# Altium schematic sheet Sheet1.SchDoc
size A4
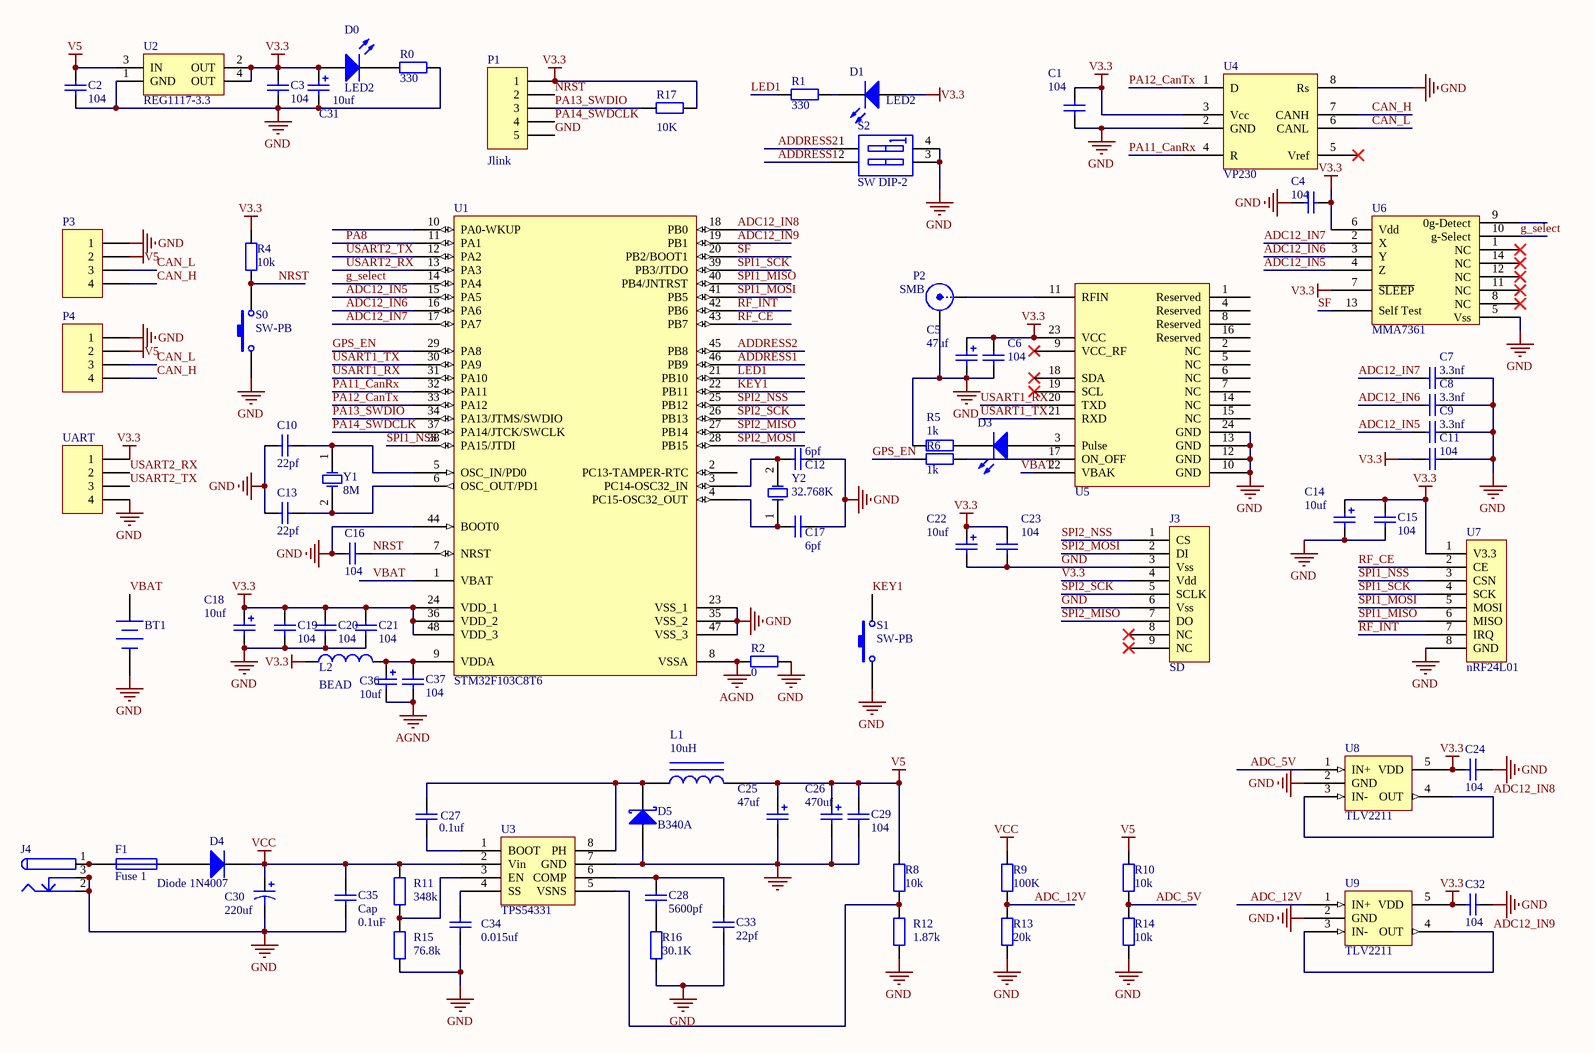
[diagram p0: Sheet1.SchDoc]

## Parts
BT1  Battery  [LI1220_1]  (value not drawn)
C1  value 104  [C0805]  (hidden comment: Cap)
C2  value 104  [C0805]  (hidden comment: Cap)
C3  value 104  [C0805]  (hidden comment: Cap)
C4  value 104  [C0805]  (hidden comment: Cap)
C5  value 47uf  [1812]  (hidden comment: Cap Pol2)
C6  value 104  [C0805]  (hidden comment: Cap)
C7  value 3.3nf  [C0805]  (hidden comment: Cap)
C8  value 3.3nf  [C0805]  (hidden comment: Cap)
C9  value 3.3nf  [C0805]  (hidden comment: Cap)
C10  value 22pf  [C0805]  (hidden comment: Cap)
C11  value 104  [C0805]  (hidden comment: Cap)
C12  value 6pf  [C0805]  (hidden comment: Cap)
C13  value 22pf  [C0805]  (hidden comment: Cap)
C14  value 10uf  [1206]  (hidden comment: Cap Pol2)
C15  value 104  [C0805]  (hidden comment: Cap)
C16  value 104  [C0805]  (hidden comment: Cap)
C17  value 6pf  [C0805]  (hidden comment: Cap)
C18  value 10uf  [1206]  (hidden comment: Cap Pol2)
C19  value 104  [C0805]  (hidden comment: Cap)
C20  value 104  [C0805]  (hidden comment: Cap)
C21  value 104  [C0805]  (hidden comment: Cap)
C22  value 10uf  [1206]  (hidden comment: Cap Pol2)
C23  value 104  [C0805]  (hidden comment: Cap)
C24  value 104  [C0805]  (hidden comment: Cap)
C25  value 47uf  [1812]  (hidden comment: Cap Pol2)
C26  value 470uf  [Cap8*8]  (hidden comment: Cap Pol2)
C27  value 0.1uf  [C0805]  (hidden comment: Cap)
C28  value 5600pf  [C0805]  (hidden comment: Cap)
C29  value 104  [C0805]  (hidden comment: Cap)
C30  value 220uf  [Cap8*8]  (hidden comment: Cap Pol1)
C31  value 10uf  [1206]  (hidden comment: Cap Pol2)
C32  value 104  [C0805]  (hidden comment: Cap)
C33  value 22pf  [C0805]  (hidden comment: Cap)
C34  value 0.015uf  [C0805]  (hidden comment: Cap)
C35  Cap  value 0.1uF  [C0805]
C36  value 10uf  [1206]  (hidden comment: Cap Pol2)
C37  value 104  [C0805]  (hidden comment: Cap)
D0  LED2  [C0805]
D1  LED2  [C0805]
D3  LED2  [C0805]  (value not drawn)
D4  Diode 1N4007  [SMB]
D5  B340A  [SMB]
F1  Fuse 1  [1812]
J3  SD  [SD_LOCK]
J4  PWR2.5  [KLD-0202]  (value not drawn)
L1  value 10uH  [l]  (hidden comment: Inductor Iron)
L2  value BEAD  [C0805]  (hidden comment: Inductor)
P1  Jlink  [HDR1X5]
P2  SMB  [SMB_V-RJ45]
P3  Header 4  [DuraClik*4]  (value not drawn)
P4  Header 4  [DuraClik*4]  (value not drawn)
R0  value 330  [C0805]  (hidden comment: Res2)
R1  value 330  [C0805]  (hidden comment: Res2)
R2  value 0  [C0805]  (hidden comment: Res2)
R4  value 10k  [C0805]  (hidden comment: Res2)
R5  value 1k  [C0805]  (hidden comment: Res2)
R6  value 1k  [C0805]  (hidden comment: Res2)
R8  value 10k  [C0805]  (hidden comment: Res2)
R9  value 100K  [C0805]  (hidden comment: Res2)
R10  value 10k  [C0805]  (hidden comment: Res2)
R11  value 348k  [C0805]  (hidden comment: Res2)
R12  value 1.87k  [C0805]  (hidden comment: Res2)
R13  value 20k  [C0805]  (hidden comment: Res2)
R14  value 10k  [C0805]  (hidden comment: Res2)
R15  value 76.8k  [C0805]  (hidden comment: Res2)
R16  value 30.1K  [C0805]  (hidden comment: Res2)
R17  value 10K  [C0805]  (hidden comment: Res2)
S0  SW-PB  [button_SMD]
S1  SW-PB  [button_SMD]
S2  SW DIP-2  [DIP-4]
U1  STM32F103C8T6  [LQFP48_N]
U2  REG1117-3.3  [ZZ311]
U3  TPS54331  [SOIC8_M]
U4  VP230  [SOP8_N]
U5  L20  [L20]  (value not drawn)
U6  MMA7361  [MMA7361 - duplicate]
U7  nRF24L01  [NRF24L01 PA]
U8  TLV2211  [SOT-23-5]
U9  TLV2211  [SOT-23-5]
UART  Header 4  [HDR1X4]  (value not drawn)
Y1  8M  [XTAL]
Y2  32.768K  [XTAL32]

## Nets
AGND: C36.2 C37.2 R2.1 U1.8(VSSA)
GND: BT1.2(-) C1.1 C2.2 C3.2 C4.1 C5.2 C6.1 C7.2 C8.2 C9.2 C10.1 C11.1 C12.1 C13.1 C14.2 C15.2 C16.1 C17.1 C18.2 C19.2 C20.2 C21.2 C22.2 C23.2 C24.2 C25.2 C26.2 C29.1 C30.2 C31.2 C32.2 C33.2 C34.2 C35.2 D5.1(A) J3.3(Vss) J3.6(Vss) J4.2 J4.2A J4.2B J4.3 J4.3A J4.3B P1.5 P2.2(Y) P3.1 P4.1 R0.1 R2.2 R5.2 R12.2 R13.2 R14.2 R15.2 R16.2 S0.1 S1.1 S2.3(B2) S2.4(B1) U1.23(VSS_1) U1.35(VSS_2) U1.44(BOOT0) U1.47(VSS_3) U2.1(GND) U3.7(GND) U4.2(GND) U4.8(Rs) U5.10(GND) U5.12(GND) U5.13(GND) U5.24(GND) U6.5(Vss) U7.8(GND) U8.2(GND) U9.2(GND) UART.4
V3.3: C1.2 C3.1 C4.2 C5.1 C6.2 C11.2 C14.1 C15.1 C18.1 C19.1 C20.1 C21.1 C22.1 C23.1 C24.1 C31.1 C32.1 D0.1(A) D1.1(A) J3.4(Vdd) L2.1 P1.1 R4.1 R17.1 U1.24(VDD_1) U1.36(VDD_2) U1.48(VDD_3) U2.2(OUT) U2.4(OUT) U4.3(Vcc) U5.23(VCC) U6.6(Vdd) U6.7(~{SLEEP}) U7.1(V3.3) U8.5(VDD) U9.5(VDD) UART.1
V5: C2.1 C25.1 C26.1 C29.2 L1.2 P3.2 P4.2 R8.1 R10.1 U2.3(IN)
VCC: C30.1 C35.1 D4.2 R9.1 R11.1 U3.2(Vin)
ADC12_IN5: C9.1 U1.15(PA5) U6.4(Z)
ADC12_IN6: C8.1 U1.16(PA6) U6.3(Y)
ADC12_IN7: C7.1 U1.17(PA7) U6.2(X)
ADC12_IN8: U1.18(PB0) U8.3(IN-) U8.4(OUT)
ADC12_IN9: U1.19(PB1) U9.3(IN-) U9.4(OUT)
ADC_5V: R10.2 R14.1 U8.1(IN+)
ADC_12V: R9.2 R13.1 U9.1(IN+)
ADDRESS1: S2.2(A2) U1.46(PB9)
ADDRESS2: S2.1(A1) U1.45(PB8)
CAN_H: P3.4 P4.4 U4.7(CANH)
CAN_L: P3.3 P4.3 U4.6(CANL)
g_select: U1.14(PA4) U6.10(g-Select)
GPS_EN: R6.1 U1.29(PA8)
KEY1: S1.2 U1.22(PB11)
LED1: R1.2 U1.21(PB10)
NRST: C16.2 P1.2 R4.2 S0.2 U1.7(NRST)
PA8: U1.11(PA1)
PA11_CanRx: U1.32(PA11) U4.4(R)
PA12_CanTx: U1.33(PA12) U4.1(D)
PA13_SWDIO: P1.3 R17.2 U1.34(PA13/JTMS/SWDIO)
PA14_SWDCLK: P1.4 U1.37(PA14/JTCK/SWCLK)
RF_CE: U1.43(PB7) U7.2(CE)
RF_INT: U1.42(PB6) U7.7(IRQ)
SF: U1.20(PB2/BOOT1) U6.13(Self_Test)
SPI1_MISO: U1.40(PB4/JNTRST) U7.6(MISO)
SPI1_MOSI: U1.41(PB5) U7.5(MOSI)
SPI1_NSS: U1.38(PA15/JTDI) U7.3(CSN)
SPI1_SCK: U1.39(PB3/JTDO) U7.4(SCK)
SPI2_MISO: J3.7(DO) U1.27(PB14)
SPI2_MOSI: J3.2(DI) U1.28(PB15)
SPI2_NSS: J3.1(CS) U1.25(PB12)
SPI2_SCK: J3.5(SCLK) U1.26(PB13)
USART1_RX: U1.31(PA10) U5.20(TXD)
USART1_TX: U1.30(PA9) U5.21(RXD)
USART2_RX: U1.13(PA3) UART.2
USART2_TX: U1.12(PA2) UART.3
VBAT: BT1.1(+) U1.1(VBAT) U5.22(VBAK)
NetC10_2: C10.2 U1.5(OSC_IN/PD0) Y1.1(OSC1)
NetC12_2: C12.2 U1.3(PC14-OSC32_IN) Y2.2(OSC2)
NetC13_2: C13.2 U1.6(OSC_OUT/PD1) Y1.2(OSC2)
NetC17_2: C17.2 U1.4(PC15-OSC32_OUT) Y2.1(OSC1)
NetC27_1: C27.1 D5.2(K) L1.1 U3.8(PH)
NetC27_2: C27.2 U3.1(BOOT)
NetC28_1: C28.1 C33.1 U3.6(COMP)
NetC28_2: C28.2 R16.1
NetC34_1: C34.1 U3.4(SS)
NetC36_1: C36.1 C37.1 L2.2 U1.9(VDDA)
NetD0_2: D0.2(K) R0.2
NetD1_2: D1.2(K) R1.1
NetD3_1: D3.1(A) U5.3(Pulse)
NetD3_2: D3.2(K) R5.1
NetD4_1: D4.1 F1.2
NetF1_1: F1.1 J4.1 J4.1A J4.1B
NetP2_1: P2.1(X) U5.11(RFIN)
NetR6_2: R6.2 U5.17(ON_OFF)
NetR8_2: R8.2 R12.1 U3.5(VSNS)
NetR11_2: R11.2 R15.1 U3.3(EN)

Not connected (* = marked no-connect by the designer): J3 8(NC)* 9(NC)*; U1 2(PC13-TAMPER-RTC) 10(PA0-WKUP); U4 5(Vref)*; U5 1(Reserved) 2(NC) 4(Reserved) 5(NC) 6(NC) 7(NC) 8(Reserved) 9(VCC_RF)* 14(NC) 15(NC) 16(Reserved) 18(SDA)* 19(SCL)*; U6 1(NC)* 8(NC)* 9(0g-Detect) 11(NC)* 12(NC)* 14(NC)*

## Library data of the parts
BT1 = Battery: Multicell Battery; Published: 24-Mar-1999; LatestRevisionDate: 17-Jul-2002; LatestRevisionNote: Re-released for DXP Platform.; PackageReference: BAT-2; Publisher: Altium Limited; PackageDescription: Battery; 2 Leads
C1-C4 C6-C13 C15-C17 C19-C21 C23 C24 C27-C29 C32-C35 C37 = Cap: Capacitor; Published: 8-Jun-2000; LatestRevisionDate: 17-Jul-2002; LatestRevisionNote: Re-released for DXP Platform.; PackageReference: RAD-0.3; Publisher: Altium Limited
  C1-C4 C6-C13 C15-C17 C19-C21 C23 C24 C27 C28 C32-C34 C37: PackageDescription: Radial Cap, Thru-Hole; 2 Leads; 0.3 in Pin Spacing
C5 C14 C18 C22 C25 C26 C31 C36 = Cap Pol2: Polarized Capacitor (Axial); Published: 8-Jun-2000; LatestRevisionDate: 17-Jul-2002; LatestRevisionNote: Re-released for DXP Platform.; PackageReference: POLAR0.8; Publisher: Altium Limited; PackageDescription: Polarized Capacitor; 2 Leads
C30 = Cap Pol1: Polarized Capacitor (Radial); Published: 8-Jun-2000; LatestRevisionDate: 17-Jul-2002; LatestRevisionNote: Re-released for DXP Platform.; PackageReference: RB7.6-15; Publisher: Altium Limited; PackageDescription: Polarized Capacitor (Radial); 2 Leads
D0 D1 D3 = LED2: Typical RED, GREEN, YELLOW, AMBER GaAs LED; Published: 8-Jun-2000; LatestRevisionDate: 17-Jul-2002; LatestRevisionNote: Re-released for DXP Platform.; PackageVersion: Feb-2002; PackageReference: 3.2X1.6X1.1; Publisher: Altium Limited
D4 = Diode 1N4007: 1 Amp General Purpose Rectifier; Published: 8-Jun-2000; LatestRevisionDate: 17-Jul-2002; LatestRevisionNote: Re-released for DXP Platform.; DatasheetVersion: 1998; PackageVersion: Aug-1999; PackageReference: DO-41; Publisher: Altium Limited; Code_JEDEC: DO-204-AL; ComponentLink1Description: Manufacturer Link; ComponentLink1URL: http://www.fairchildsemi.com/; ComponentLink2Description: Datasheet; ComponentLink2URL: http://www.fairchildsemi.com/ds/1N%2F1N4001.pdf
D5 = Diode 11DQ03: Schottky Rectifier; Published: 8-Jun-2000; LatestRevisionDate: 17-Jul-2002; LatestRevisionNote: Re-released for DXP Platform.; DatasheetVersion: Dec-1997; PackageReference: DO-204AL; Publisher: Altium Limited; Code_JEDEC: DO-204-AL; ComponentLink1Description: Manufacturer Link; ComponentLink1URL: http://www.irf.com/; ComponentLink2Description: Datasheet; ComponentLink2URL: http://www.irf.com/product-info/datasheets/data/11dq03.pdf
F1 = Fuse 1: Fuse; Published: 8-Jun-2000; LatestRevisionDate: 17-Jul-2002; LatestRevisionNote: Re-released for DXP Platform.; PackageReference: PIN-W2/E2.8; Publisher: Altium Limited; PackageDescription: Thru-Hole; 2 Leads
J3 = SD: Full-size SD Memory Card
J4 = PWR2.5: Low Voltage Power Supply Connector; Published: 17-Dec-2003; DatasheetDocument: 09-May-2002; Publisher: Altium Limited; ComponentLink1Description: Manufacturer Link; ComponentLink1URL: http://domino.kycon.com/internet/Products.html
L1 = Inductor Iron: Magnetic-Core Inductor; Published: 24-Mar-1999; LatestRevisionDate: 17-Jul-2002; LatestRevisionNote: Re-released for DXP Platform.; PackageReference: AXIAL-0.9; Publisher: Altium Limited; PackageDescription: Axial Device, Thru-Hole; 2 Leads; 0.9 in Pin Spacing
L2 = Inductor: Code_IEC: 1005; Published: 8-Jun-2000; LatestRevisionDate: 29-May-2009; LatestRevisionNote: IPC-7351 Footprint Added.; PackageReference: 0402-A; Publisher: Altium Limited; PackageDescription: Chip Inductor; Code_JEITA: 0402
P1 = Header 5: Header, 5-Pin; LatestRevisionDate: 17-Jul-2002; LatestRevisionNote: Re-released for DXP Platform.; Publisher: Altium Limited
P2 = SMB: SMB Straight Connector; LatestRevisionDate: 17-Jul-2002; LatestRevisionNote: Re-released for DXP Platform.; Publisher: Altium Limited
P3 P4 UART = Header 4: Header, 4-Pin; LatestRevisionDate: 17-Jul-2002; LatestRevisionNote: Re-released for DXP Platform.; Publisher: Altium Limited
R0-R2 R4-R6 R8-R17 = Res2: Resistor; Published: 8-Jun-2000; LatestRevisionDate: 17-Jul-2002; LatestRevisionNote: Re-released for DXP Platform.; PackageReference: AXIAL-0.4; Publisher: Altium Limited
  R0-R2 R4-R6 R8-R16: PackageDescription: Axial Device, Thru-Hole; 2 Leads; 0.4 in Pin Spacing
S0 S1 = SW-PB: Switch; Published: 24-Mar-1999; LatestRevisionDate: 17-Jul-2002; LatestRevisionNote: Re-released for DXP Platform.; PackageReference: SPST-2; Publisher: Altium Limited; PackageDescription: Switch; 2 Leads
S2 = SW DIP-2: DIP Switch, 2 Position, SPST; Published: 24-Mar-1999; LatestRevisionDate: 17-Jul-2002; LatestRevisionNote: Re-released for DXP Platform.; PackageReference: DIP-4; Publisher: Altium Limited
U1 = STM32F103C8T6: STM32 ARM-based 32-bit MCU with 64 Kbytes Flash, 48-pin LQFP, Industrial Temperature; Published: 30-May-2008; DatasheetVersion: rev6, Mar-2008; PackageVersion: Mar-2008; PackageReference: LQFP48; Publisher: Altium Limited; PackageDescription: 48-Pin Low-Profile Quad Flat Pack, 7 x 7 mm Body, 0.5 mm Pitch (LQFP48); ComponentLink1Description: Manufacturer Link; ComponentLink1URL: www.st.com/stm32; ComponentLink2Description: Datasheet; ComponentLink2URL: http://www.st.com/stonline/products/literature/ds/13587.pdf
U2 = REG1117-3.3: 800mA and 1A Low Dropout Positive Regulator 2.85V, 3.3V, 5V, and Adjustable; Published: 8-Jun-2000; LatestRevisionDate: 17-Jul-2002; LatestRevisionNote: Re-released for DXP Platform.; DatasheetVersion: Sep-1997; PackageVersion: revC; PackageReference: ZZ311; Publisher: Altium Limited; PackageDescription: SOT-223/SC-73; 4 Leads; Body 6.7 x 7.3 mm, inc. leads (LxW max); ComponentLink1Description: Manufacturer Link; ComponentLink1URL: http://www.ti.com/; ComponentLink2Description: Datasheet; ComponentLink2URL: http://www-s.ti.com/sc/ds/REG1117.pdf
U3 = TPS54331: 3A,28VINPUT, STEPDOWNSWIFT?DC/DCCONVERTERWITHECO-MODE?
U4 = VP230: 3.3-VCANTRANSCEIVERS
U7 = nRF24L01: nRF24L01+PA+LNA
Y1 Y2 = XTAL: Crystal Oscillator; Published: 8-Jun-2000; LatestRevisionDate: 17-Jul-2002; LatestRevisionNote: Re-released for DXP Platform.; PackageReference: R38; Publisher: Altium Limited; PackageDescription: Crystal, Thru-Hole; 2 Leads; Body 3.1 x 8.2 mm (Dia.xH)